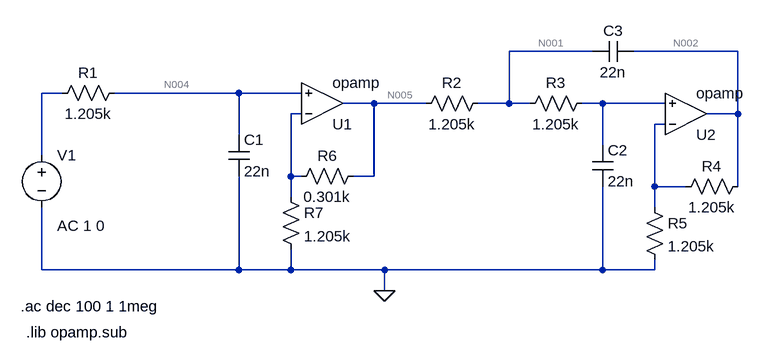
[diagram p0: schematic 3rd_order_Theory_fc_6_5_k_5.asc]
3rd_order_Theory_fc_6_5_k_5.asc, the LTspice schematic file:
Version 4
SHEET 1 880 680
WIRE 144 -320 16 -320
WIRE 368 -320 208 -320
WIRE -672 -256 -704 -256
WIRE -400 -256 -592 -256
WIRE -304 -256 -400 -256
WIRE -192 -240 -240 -240
WIRE -112 -240 -192 -240
WIRE 16 -240 16 -320
WIRE 16 -240 -32 -240
WIRE 48 -240 16 -240
WIRE 160 -240 128 -240
WIRE 256 -240 160 -240
WIRE -304 -224 -320 -224
WIRE 368 -224 368 -320
WIRE 368 -224 320 -224
WIRE 256 -208 240 -208
WIRE -400 -192 -400 -256
WIRE 160 -176 160 -240
WIRE -704 -160 -704 -256
WIRE -320 -128 -320 -224
WIRE -304 -128 -320 -128
WIRE -192 -128 -192 -240
WIRE -192 -128 -224 -128
WIRE 240 -112 240 -208
WIRE 288 -112 240 -112
WIRE 368 -112 368 -224
WIRE -320 -96 -320 -128
WIRE 240 -80 240 -112
WIRE -704 16 -704 -80
WIRE -400 16 -400 -128
WIRE -400 16 -704 16
WIRE -320 16 -320 -16
WIRE -320 16 -400 16
WIRE -176 16 -320 16
WIRE 160 16 160 -112
WIRE 160 16 -176 16
WIRE 240 16 240 0
WIRE 240 16 160 16
WIRE -176 48 -176 16
FLAG -176 48 0
SYMBOL opamp -272 -176 M180
SYMATTR InstName U1
SYMBOL res -688 -240 R270
WINDOW 0 32 56 VTop 2
WINDOW 3 0 56 VBottom 2
SYMATTR InstName R1
SYMATTR Value 1.205k
SYMBOL cap -416 -192 R0
SYMATTR InstName C1
SYMATTR Value 22n
SYMBOL opamp 288 -160 M180
SYMATTR InstName U2
SYMBOL res -128 -224 R270
WINDOW 0 32 56 VTop 2
WINDOW 3 0 56 VBottom 2
SYMATTR InstName R2
SYMATTR Value 1.205k
SYMBOL res 32 -224 R270
WINDOW 0 32 56 VTop 2
WINDOW 3 0 56 VBottom 2
SYMATTR InstName R3
SYMATTR Value 1.205k
SYMBOL res 272 -96 R270
WINDOW 0 32 56 VTop 2
WINDOW 3 0 56 VBottom 2
SYMATTR InstName R4
SYMATTR Value 1.205k
SYMBOL res 224 -96 R0
SYMATTR InstName R5
SYMATTR Value 1.205k
SYMBOL cap 144 -176 R0
SYMATTR InstName C2
SYMATTR Value 22n
SYMBOL cap 144 -304 R270
WINDOW 0 32 32 VTop 2
WINDOW 3 0 32 VBottom 2
SYMATTR InstName C3
SYMATTR Value 22n
SYMBOL voltage -704 -176 R0
WINDOW 123 24 124 Left 2
WINDOW 39 0 0 Left 2
SYMATTR Value2 AC 1 0
SYMATTR InstName V1
SYMATTR Value ""
SYMBOL res -208 -144 R90
WINDOW 0 0 56 VBottom 2
WINDOW 3 32 56 VTop 2
SYMATTR InstName R6
SYMATTR Value 0.301k
SYMBOL res -336 -112 R0
SYMATTR InstName R7
SYMATTR Value 1.205k
TEXT -736 72 Left 2 !.ac dec 100 1 1meg
TEXT -728 112 Left 2 !.lib opamp.sub

The netlist it stands for:
* 3rd_order_Theory_fc_6_5_k_5.asc
XU1 N007 N004 N005 opamp Aol=100K GBW=10Meg  ; pins invin noninvin out
R1 N003 N004 1.205k
C1 N004 0 22n
XU2 N008 N006 N002 opamp Aol=100K GBW=10Meg  ; pins invin noninvin out
R2 N005 N001 1.205k
R3 N001 N006 1.205k
R4 N008 N002 1.205k
R5 N008 0 1.205k
C2 N006 0 22n
C3 N001 N002 22n
V1 N003 0 AC 1 0
R6 N005 N007 0.301k
R7 N007 0 1.205k
.ac dec 100 1 1meg
.lib opamp.sub
.backanno
.end

* Results of the author's LTspice run, read from the files saved beside the schematic
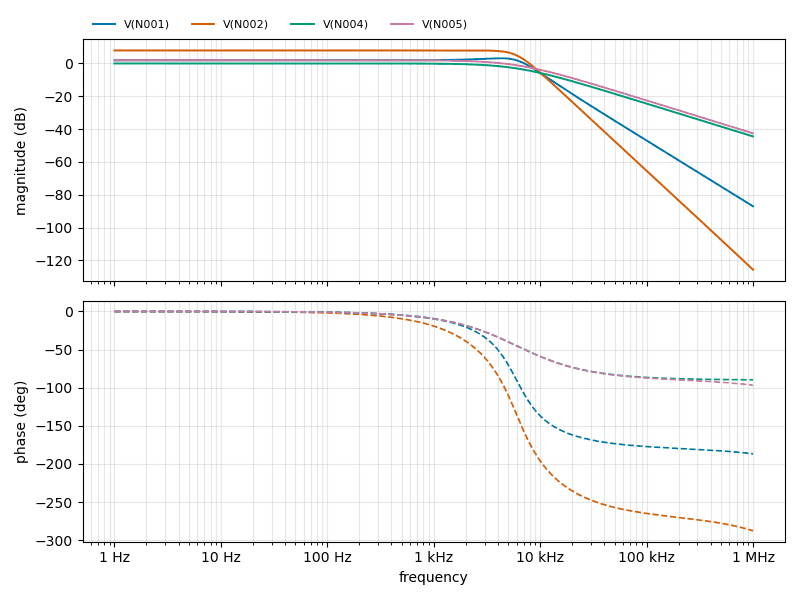
[diagram p1: AC Analysis of 3rd_order_Theory_fc_6_5_k_5.asc, plotted from the saved traces]
* AC Analysis, 1 run:
*   V(N001): 1.94 dB at 1 Hz, -87.01 dB at 1 MHz, peak 3.19 dB at 4.266 kHz, 3 dB below the peak at 7.009 kHz
*   V(N002): 7.96 dB at 1 Hz, -125.60 dB at 1 MHz, peak 7.96 dB at 1.202 kHz, 3 dB below the peak at 6.002 kHz
*   V(N004): -0.00 dB at 1 Hz, -44.43 dB at 1 MHz, peak -0.00 dB at 1 Hz, 3 dB below the peak at 6.003 kHz
*   V(N005): 1.94 dB at 1 Hz, -42.56 dB at 1 MHz, peak 1.94 dB at 1 Hz, 3 dB below the peak at 6.003 kHz